# EasyEDA schematic AchszaehlerMesseinheitCH32V003F4P6.json
TITLE: Sheet_1; REV: 1.0; Date: 2025-05-25; Sheet: 1/1; Drawn By: spamundwerbung3; Company: Your Company
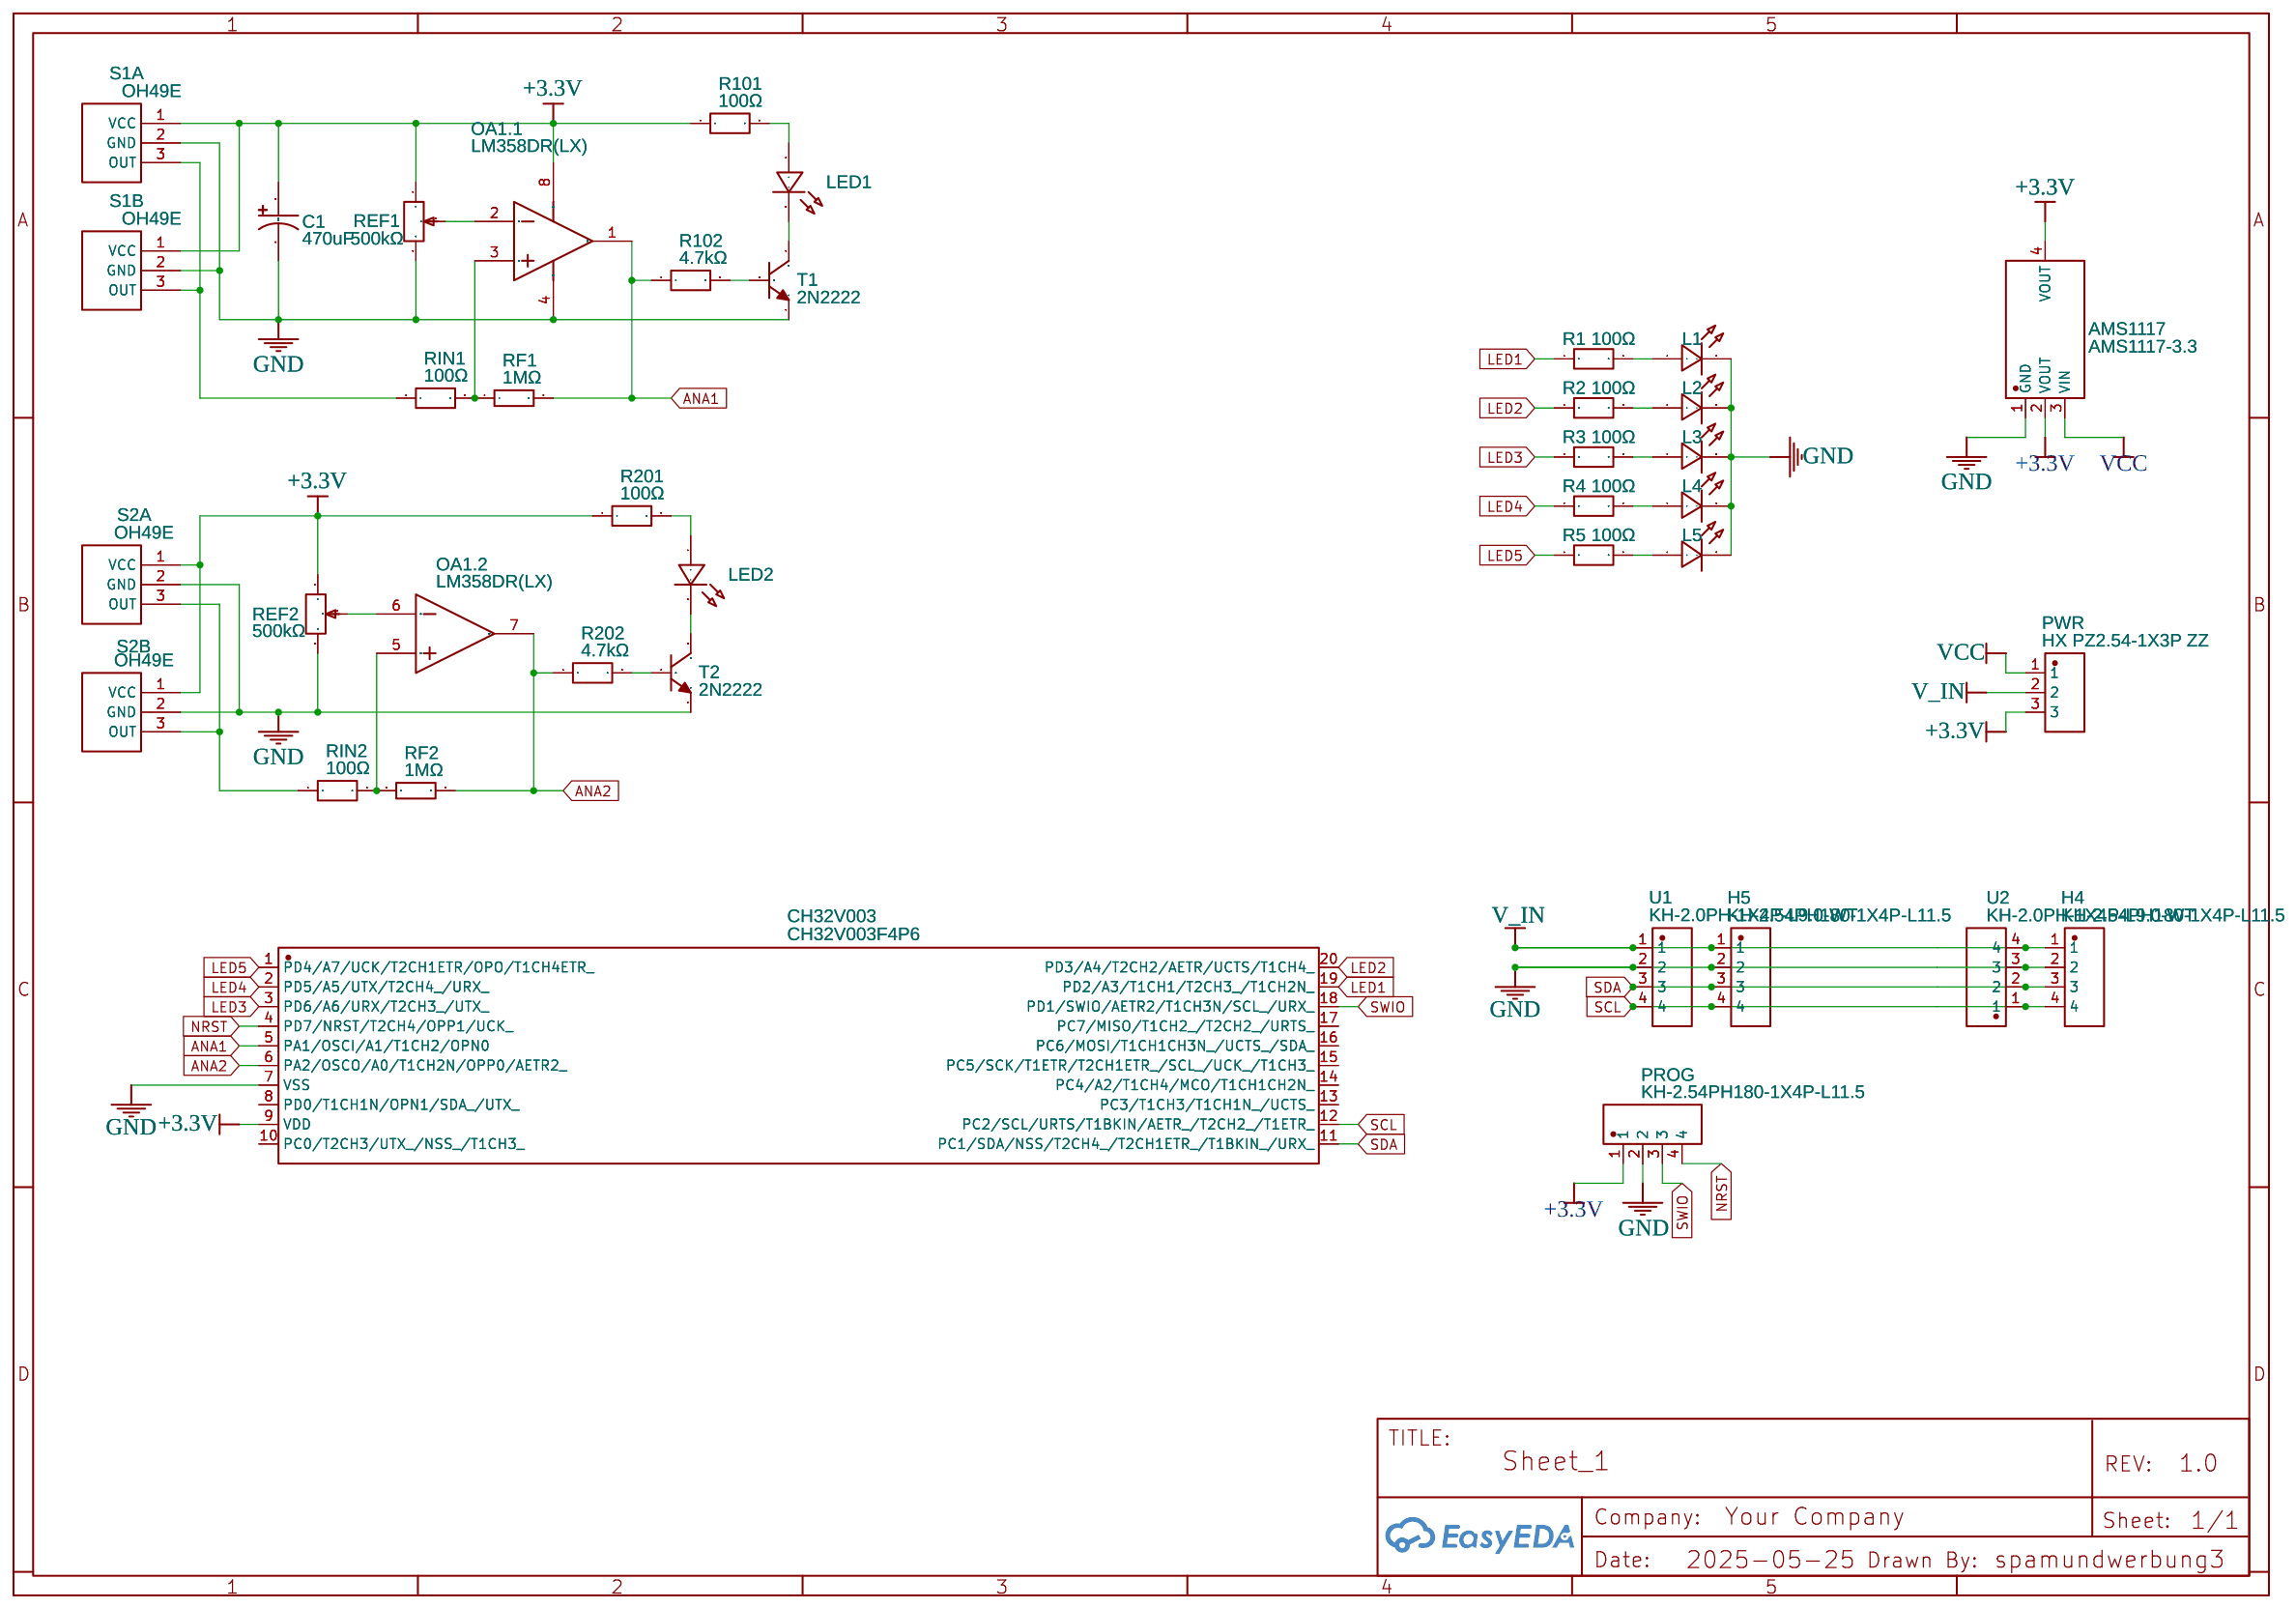
[diagram p0: schematic sheet]

## Parts
AMS1117  AMS1117-3.3  [SOT-223-3_L6.5-W3.4-P2.30-LS7.0-BR]
C1  470uF  [CAP-TH_BD6.3-P2.50-D1.0-FD]
CH32V003  CH32V003F4P6  [TSSOP-20_L6.5-W4.4-P0.65-LS6.4-BL]
H4  KH-2.54PH180-1X4P-L11.5  [HDR-TH_4P-P2.54-V-M]
H5  KH-2.54PH180-1X4P-L11.5  [HDR-TH_4P-P2.54-V-M]
L1  MIR60363T-06030IRLED-EVERLIGHT  [LED0603-FD]
L2  MIR60363T-06030IRLED-EVERLIGHT  [LED0603-FD]
L3  MIR60363T-06030IRLED-EVERLIGHT  [LED0603-FD]
L4  MIR60363T-06030IRLED-EVERLIGHT  [LED0603-FD]
L5  MIR60363T-06030IRLED-EVERLIGHT  [LED0603-FD]
LED1  MIR60363T-06030IRLED-EVERLIGHT  [LED0603-FD]
LED2  MIR60363T-06030IRLED-EVERLIGHT  [LED0603-FD]
OA1  LM358DR(LX)  [SOP-8_L4.9-W3.9-P1.27-LS6.0-BL]  (sections 1,2)
PROG  KH-2.54PH180-1X4P-L11.5  [HDR-TH_4P-P2.54-V-M]
PWR  HX PZ2.54-1X3P ZZ  [CONN-TH_HX-PZ2.54-1X3P-ZZ]
R1  100Ω  [R0603]
R2  100Ω  [R0603]
R3  100Ω  [R0603]
R4  100Ω  [R0603]
R5  100Ω  [R0603]
R101  100Ω  [R0603]
R102  4.7kΩ  [R0603]
R201  100Ω  [R0603]
R202  4.7kΩ  [R0603]
REF1  500kΩ  [RES-ADJ-SMD_RM065-V1]
REF2  500kΩ  [RES-ADJ-SMD_RM065-V1]
RF1  1MΩ  [R0603]
RF2  1MΩ  [R0603]
RIN1  100Ω  [R0603]
RIN2  100Ω  [R0603]
S1A  OH49E  [OH49E]
S1B  OH49E  [OH49E]
S2A  OH49E  [OH49E]
S2B  OH49E  [OH49E]
T1  2N2222  [TO-92-3_L4.5-W3.5-P1.27-L]
T2  2N2222  [TO-92-3_L4.5-W3.5-P1.27-L]
U1  KH-2.0PH-1X4P-L9.0-WT  [CONN-SMD_KH-2.0PH-1X4P-L9.0-WT]
U2  KH-2.0PH-1X4P-L9.0-WT  [CONN-SMD_KH-2.0PH-1X4P-L9.0-WT]

## Library data of the parts
AMS1117 = AMS1117-3.3: sourceId: dwIGgezVh; Supplier: LCSC; Manufacturer: AMS; Supplier Part: C6186; JLCPCB Part Class: Basic Part
C1 = UKW1A471MED: Contributor: LCSC; Supplier: LCSC; Supplier Part: C250972; Manufacturer: Nichicon(尼吉康); JLCPCB Part Class: Extended Part
CH32V003 = CH32V003F4P6: Contributor: lcsc; Supplier: LCSC; Supplier Part: C5187096; Manufacturer: WCH(南京沁恒); JLCPCB Part Class: Extended Part
H4 H5 PROG = KH-2.54PH180-1X4P-L11.5: Contributor: LCSC; Supplier: LCSC; Supplier Part: C2905435; Manufacturer: kinghelm(金航标); JLCPCB Part Class: Extended Part
L1-L5 LED1 LED2 = MIR60363T-06030IRLED-EVERLIGHT: Supplier: LCSC; Supplier Part: C9900135377; Manufacturer: null; Manufacturer Part: MIR60363T-06030IRLED-everlight; JLCPCB Part Class: Extended Part; Contributor: lcsc
OA1 = LM358DR(LX): Supplier: LCSC; Supplier Part: C24833647; Manufacturer: LX(灵星芯微); JLCPCB Part Class: Extended Part; subpart_no: 1
PWR = HX PZ2.54-1X3P ZZ: Supplier: LCSC; Supplier Part: C32713269; Manufacturer: hanxia(韩下); Manufacturer Part: HX PZ2.54-1x3P ZZ; JLCPCB Part Class: Extended Part; Contributor: lcsc
R1-R5 R101 R201 RIN1 RIN2 = CR0603-10W-1000FT: Supplier: LCSC; Supplier Part: C4041881; Manufacturer: Venkel; JLCPCB Part Class: Extended Part; Contributor: lcsc
R102 R202 = CR0603F4K70P05Z: Contributor: LCSC; Supplier: LCSC; Supplier Part: C881083; Manufacturer: EVER OHMS(天二科技); JLCPCB Part Class: Extended Part
REF1 REF2 = RM065-504(500K) VARIABLE TRIANGULAR: Contributor: lcsc; Supplier: LCSC; Supplier Part: C5205026; Manufacturer: BOCHEN(博晨); Manufacturer Part: RM065-504(500K)
RF1 RF2 = ETCR0603F1M00K9: Contributor: LCSC; Supplier: LCSC; Supplier Part: C365401; Manufacturer: RESI(开步睿思); JLCPCB Part Class: Extended Part
S1A S1B S2A S2B = OH49E: Supplier: LCSC; Manufacturer: OUZHUO; image: //image.lceda.cn/szlcsc/C81386.jpg; Supplier Part: C81386
T1 T2 = 2N2222A_C20616319: Supplier: LCSC; Supplier Part: C20616319; Manufacturer: HXY MOSFET(华轩阳电子); Manufacturer Part: 2N2222A; JLCPCB Part Class: Extended Part; Contributor: lcsc
U1 U2 = KH-2.0PH-1X4P-L9.0-WT: Supplier: LCSC; Supplier Part: C20610328; Manufacturer: kinghelm(金航标); Contributor: lcsc; JLCPCB Part Class: Extended Part

## Nets
+3.3V: AMS1117.2(VOUT) AMS1117.4(VOUT) C1.1 CH32V003.9(VDD) OA1.8(VCC+) PROG.1 PWR.3 R101.1 R201.1 REF1.1 REF2.1 S1A.1(VCC) S1B.1(VCC) S2A.1(VCC) S2B.1(VCC)
GND: AMS1117.1(GND) C1.2 CH32V003.7(VSS) H4.2 H5.2 L1.2(-) L2.2(-) L3.2(-) L4.2(-) L5.2(-) OA1.4(VCC-) PROG.2 REF1.3 REF2.3 S1A.2(GND) S1B.2(GND) S2A.2(GND) S2B.2(GND) T1.1(E) T2.1(E) U1.2 U2.3
VCC: AMS1117.3(VIN) PWR.1
ANA1: CH32V003.5(PA1/OSCI/A1/T1CH2/OPN0) OA1.1(1OUT) R102.1 RF1.2
ANA2: CH32V003.6(PA2/OSCO/A0/T1CH2N/OPP0/AETR2_) OA1.7(2OUT) R202.1 RF2.2
LED1: CH32V003.19(PD2/A3/T1CH1/T2CH3_/T1CH2N_) R1.1
LED2: CH32V003.20(PD3/A4/T2CH2/AETR/UCTS/T1CH4_) R2.1
LED3: CH32V003.3(PD6/A6/URX/T2CH3_/UTX_) R3.1
LED4: CH32V003.2(PD5/A5/UTX/T2CH4_/URX_) R4.1
LED5: CH32V003.1(PD4/A7/UCK/T2CH1ETR/OPO/T1CH4ETR_) R5.1
NRST: CH32V003.4(PD7/NRST/T2CH4/OPP1/UCK_) PROG.4
SCL: CH32V003.12(PC2/SCL/URTS/T1BKIN/AETR_/T2CH2_/T1ETR_) H4.4 H5.4 U1.4 U2.1
SDA: CH32V003.11(PC1/SDA/NSS/T2CH4_/T2CH1ETR_/T1BKIN_/URX_) H4.3 H5.3 U1.3 U2.2
SWIO: CH32V003.18(PD1/SWIO/AETR2/T1CH3N/SCL_/URX_) PROG.3
V_IN: H4.1 H5.1 PWR.2 U1.1 U2.4
Net-(L1-1): L1.1(+) R1.2
Net-(L2-1): L2.1(+) R2.2
Net-(L3-1): L3.1(+) R3.2
Net-(L4-1): L4.1(+) R4.2
Net-(L5-1): L5.1(+) R5.2
Net-(LED1-1): LED1.1(+) R101.2
Net-(LED1-2): LED1.2(-) T1.3(C)
Net-(LED2-1): LED2.1(+) R201.2
Net-(LED2-2): LED2.2(-) T2.3(C)
Net-(OA1.1-2): OA1.2(1IN-) REF1.2
Net-(OA1.1-3): OA1.3(1IN+) RF1.1 RIN1.2
Net-(OA1.2-5): OA1.5(2IN+) RF2.1 RIN2.2
Net-(OA1.2-6): OA1.6(2IN-) REF2.2
Net-(R102-2): R102.2 T1.2(B)
Net-(R202-2): R202.2 T2.2(B)
Net-(RIN1-1): RIN1.1 S1A.3(OUT) S1B.3(OUT)
Net-(RIN2-1): RIN2.1 S2A.3(OUT) S2B.3(OUT)

Not connected (* = marked no-connect by the designer): CH32V003 8(PD0/T1CH1N/OPN1/SDA_/UTX_) 10(PC0/T2CH3/UTX_/NSS_/T1CH3_) 13(PC3/T1CH3/T1CH1N_/UCTS_) 14(PC4/A2/T1CH4/MCO/T1CH1CH2N_) 15(PC5/SCK/T1ETR/T2CH1ETR_/SCL_/UCK_/T1CH3_) 16(PC6/MOSI/T1CH1CH3N_/UCTS_/SDA_) 17(PC7/MISO/T1CH2_/T2CH2_/URTS_)
